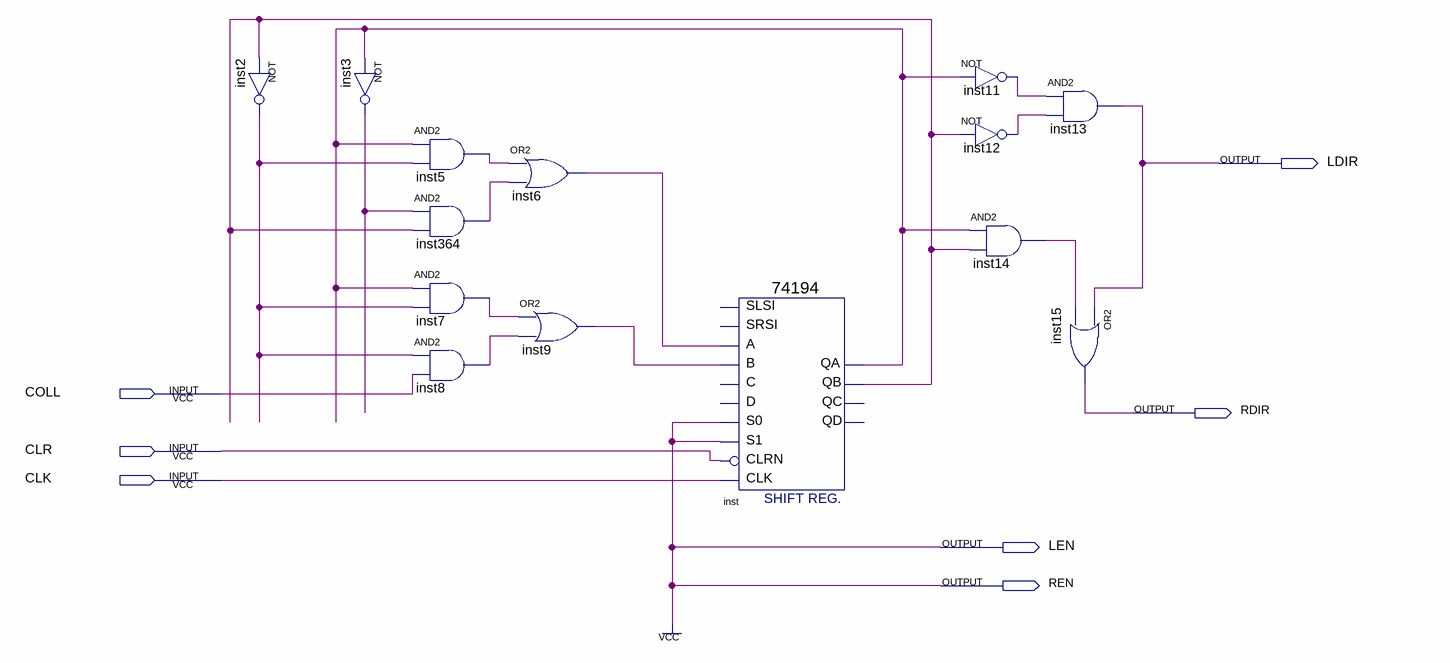
[diagram p0: schematic sheet]
// Quartus schematic digibot.bdf as structural Verilog: 14 symbols, 7 pins
module digibot (
  input  COLL,
  input  CLR,
  input  CLK,
  output LDIR,
  output RDIR,
  output LEN,
  output REN
);

  wire inst2_out, inst3_out, inst5_out, inst6_out, inst7_out, inst8_out, inst9_out, inst11_out, inst12_out,
       inst14_out, inst364_out, inst_qa, inst_qb;

  not inst2 (inst2_out, inst_qb);
  not inst3 (inst3_out, inst_qa);
  and inst5 (inst5_out, inst_qa, inst2_out);
  and inst364 (inst364_out, inst3_out, inst_qb);
  and inst7 (inst7_out, inst_qa, inst2_out);
  and inst8 (inst8_out, inst2_out, COLL);
  or inst6 (inst6_out, inst5_out, inst364_out);
  or inst9 (inst9_out, inst7_out, inst8_out);
  \74194  inst (
    .B(inst9_out), .CLK(CLK), .CLRN(CLR), .S1(1'b1), .S0(1'b1), .A(inst6_out), .QA(inst_qa), .QB(inst_qb));  // open: SLSI, SRSI, C, D, QC, QD
  not inst11 (inst11_out, inst_qa);
  not inst12 (inst12_out, inst_qb);
  and inst14 (inst14_out, inst_qa, inst_qb);
  and inst13 (LDIR, inst11_out, inst12_out);
  or inst15 (RDIR, LDIR, inst14_out);

  assign LEN = 1'b1;
  assign REN = 1'b1;
endmodule
